# EAGLE schematic Arduino_S3v3_R2 (EAGLE 6.2)
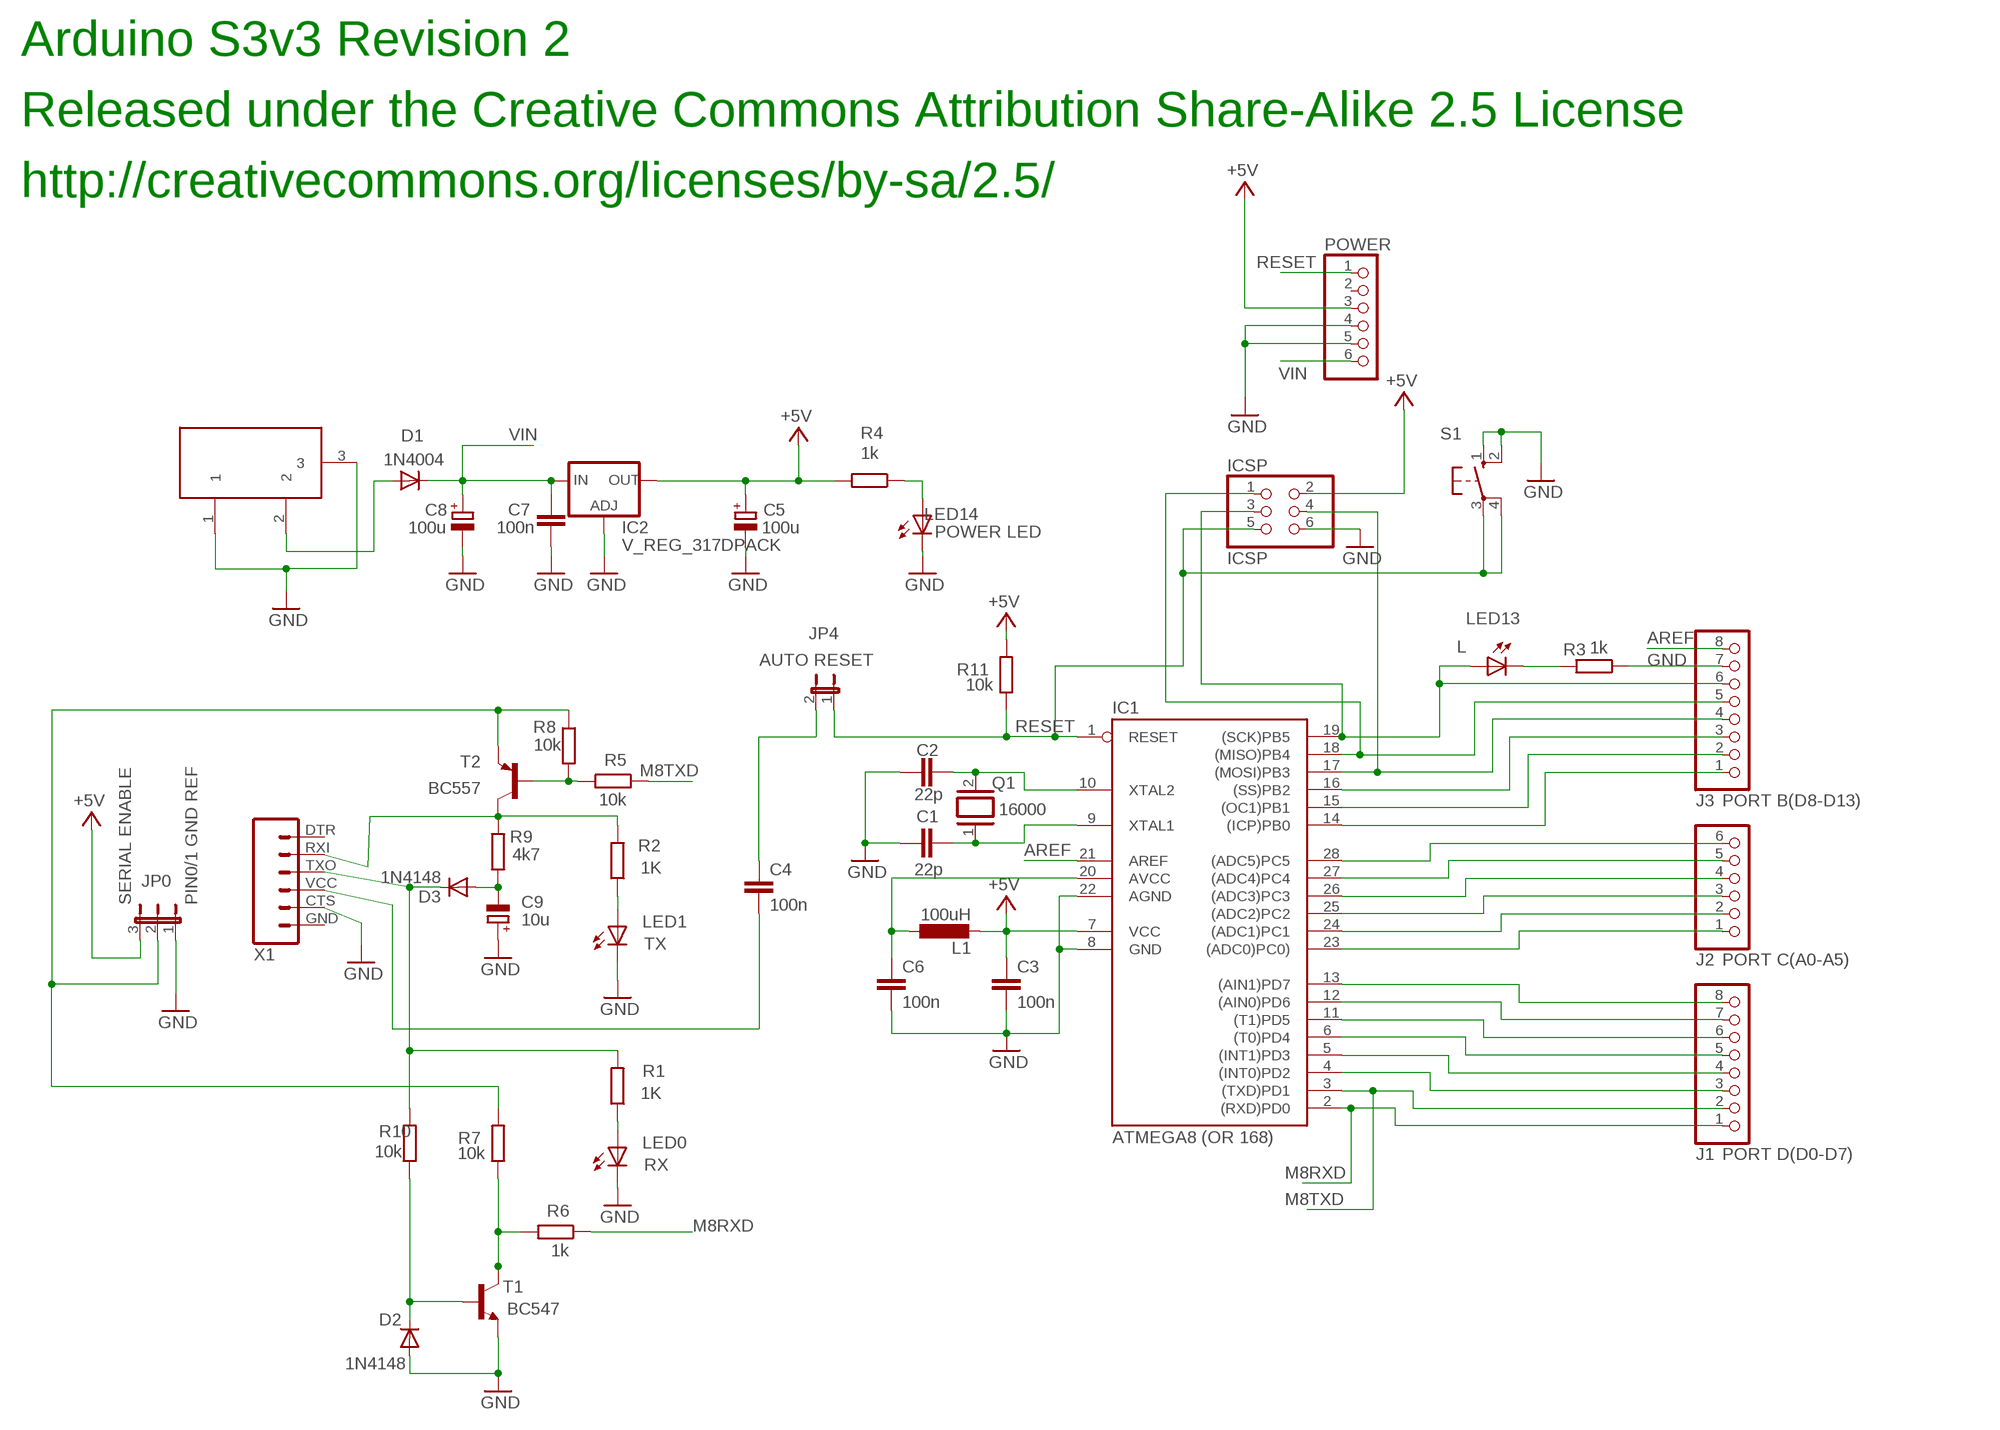
[diagram p0: schematic, sheet 1]

## Parts
C1  22p  C-EUC0805  [C0805]
C2  22p  C-EUC0805  [C0805]
C3  100n  C-EUC0805  [C0805]
C4  100n  C-EUC0805  [C0805]
C5  100u  CPOL-EUE3.5-8  [E3,5-8]
C6  100n  C-EUC0805  [C0805]
C7  100n  C-EUC0805  [C0805]
C8  100u  CPOL-EUE3.5-8  [E3,5-8]
C9  10u  CPOL-EUE5-6  [E5-6]
D1  1N4004  [DO41-10]
D2  1N4148  [DO35-10]
D3  1N4148  [DO35-10]
DC1  DC21MMX  [DC-21MM]
IC1  ATMEGA8 (OR 168)  AT90S4433P  [DIL28-3]
IC2  V_REG_317DPACK  [V-REG_DPACK]
ICSP  ICSP  PINHD-2X3  [2X03]
J1  PORT D(D0-D7)  PINHD-1X8  [1X08]
J2  PORT C(A0-A5)  PINHD-1X6  [1X06]
J3  PORT B(D8-D13)  PINHD-1X8  [1X08]
JP0  JP2W  [JP2W]
JP4  AUTO RESET  JP1W  [JP1W]
L1  100uH  L-EUL8530M  [L8530M]
LED0  RX  LEDCHIPLED_0603  [CHIPLED_0603]
LED1  TX  LEDCHIPLED_0603  [CHIPLED_0603]
LED13  L  LEDCHIPLED_0603  [CHIPLED_0603]
LED14  POWER LED  LEDCHIPLED_0603  [CHIPLED_0603]
POWER  PINHD-1X6  [1X06]
Q1  16000  XTAL  [Q]
R1  1K  R-EU_M0805  [M0805]
R2  1K  R-EU_M0805  [M0805]
R3  1k  R-EU_M0805  [M0805]
R4  1k  R-EU_M0805  [M0805]
R5  10k  R-EU_R0805  [R0805]
R6  1k  R-EU_R0805  [R0805]
R7  10k  R-EU_M0805  [M0805]
R8  10k  R-EU_M0805  [M0805]
R9  4k7  R-EU_M0805  [M0805]
R10  10k  R-EU_M0805  [M0805]
R11  10k  R-EU_M0805  [M0805]
S1  10-XX  [B3F-10XX]
T1  BC547  [TO92]
T2  BC557  BC557B-PNP-TO92-EBC  [TO92-EBC]
X1  FTDI_BASICPTH  [FTDI_BASIC]

## Nets
+5V [power]: C3.1 C5.+ IC1.7(VCC) IC2.4(OUT) ICSP.2 JP0.3 L1.2 POWER.3 R4.2 R11.2
AREF: IC1.21(AREF) J3.8
GND: C1.1 C2.1 C3.2 C5.- C6.2 C7.1 C8.- C9.+ D2.A DC1.1 DC1.3 IC1.8(GND) IC1.22(AGND) IC2.1(ADJ) ICSP.6 J3.7 JP0.1 LED0.C LED1.C LED14.C POWER.4 POWER.5 R3.1 S1.1(S) S1.2(S1) T1.1(E) X1.CTS
M8RXD: IC1.2((RXD)PD0) J1.1 R6.1
M8TXD: IC1.3((TXD)PD1) J1.2 R5.1
N$1: IC1.18((MISO)PB4) ICSP.1 J3.5
N$2: C9.- D3.A R9.1
N$3: LED14.A R4.1
N$4: IC1.17((MOSI)PB3) ICSP.4 J3.4
N$5: IC1.14((ICP)PB0) J3.1
N$6: C1.2 IC1.9(XTAL1) Q1.1
N$7: C2.2 IC1.10(XTAL2) Q1.2
N$8: D1.A DC1.2
N$10: IC1.4((INT0)PD2) J1.3
N$11: IC1.5((INT1)PD3) J1.4
N$12: IC1.6((T0)PD4) J1.5
N$13: IC1.11((T1)PD5) J1.6
N$14: IC1.12((AIN0)PD6) J1.7
N$15: IC1.13((AIN1)PD7) J1.8
N$16: IC1.23((ADC0)PC0)) J2.1
N$17: IC1.24((ADC1)PC1) J2.2
N$18: IC1.25((ADC2)PC2) J2.3
N$19: IC1.26((ADC3)PC3) J2.4
N$20: IC1.27((ADC4)PC4) J2.5
N$21: IC1.28((ADC5)PC5) J2.6
N$22: IC1.15((OC1)PB1) J3.2
N$23: IC1.16((SS)PB2) J3.3
N$25: D3.C R1.2 R10.2 X1.TXO
N$26: R6.2 R7.1 T1.3(C)
N$27: R5.2 R8.2 T2.B
N$29: D2.C R10.1 T1.2(B)
N$31: LED13.C R3.2
N$32: LED1.A R2.1
N$33: LED0.A R1.1
N$34: C4.1 JP4.2
N$38: C4.2 X1.VCC
N$39: R2.2 R9.2 T2.C X1.RXI
N$42 [power]: C6.1 IC1.20(AVCC) L1.1
RESET: IC1.1(RESET) ICSP.5 JP4.1 POWER.1 R11.1 S1.3(P) S1.4(P1)
SCK: IC1.19((SCK)PB5) ICSP.3 J3.6 LED13.A
SERIAL_VCC: JP0.2 R7.2 R8.1 T2.E
VIN [power]: C7.2 C8.+ D1.C IC2.3(IN) POWER.6
Unconnected: POWER.2 X1.DTR X1.GND

## Notes on the sheet
- Arduino S3v3 Revision 2
- Released under the Creative Commons Attribution Share-Alike 2.5 License
- http://creativecommons.org/licenses/by-sa/2.5/
- SERIAL ENABLE | PIN0/1 GND REF

## Library data of the parts
C1-C4 C6 C7 = rcl:C-EU: CAPACITOR, European symbol
C5 C8 C9 = rcl:CPOL-EU: POLARIZED CAPACITOR, European symbol
D1 = diode:1N4004: DIODE general purpose rectifier, 1 A
D2 D3 = diode:1N4148: DIODE high speed (Philips)
DC1 = powersupply:DC21MM
IC1 = atmel:AT90S4433: MICROCONTROLLER 4 Kbytes FLASH 128 bytes SRAM 256 bytes EEPROM UART 6-channel 10 bit ADC
IC2 = SparkFun:V_REG_317: Voltage Regulator Standard LM317 adjustable voltage regulator. AOI (Adjust Output Input). Google 'LM317 Calculator' for easy to use app to get the two resistor values needed. 240/720 for 5V output. 240/390 for 3.3V output. Spark Fun Electronics SKU : COM-00527
ICSP = pinhead:PINHD-2X3: PIN HEADER
J1 J3 = pinhead:PINHD-1X8: PIN HEADER
J2 POWER = pinhead:PINHD-1X6: PIN HEADER
JP0 = jumper:JP2W: JUMPER
JP4 = jumper:JP1W
L1 = rcl:L-EU: INDUCTOR, European symbol
LED0 LED1 LED13 LED14 = led:LED: LED OSRAM: - CHIPLED LG R971, LG N971, LY N971, LG Q971, LY Q971, LO R971, LY R971 LH N974, LH R974 LS Q976, LO Q976, LY Q976 LO Q996 - Hyper CHIPLED LW Q18S LB Q993, LB Q99A, LB R99A - SideLED LS A670, LO A670, LY A670, LG A670, LP A670 LB A673, LV A673, LT A673, LW A673 LH A674 LY A675 LS A676, LA A676, LO A676, LY A676, LW A676 LS A679, LY A679, LG A679 - Hyper Micro SIDELED® LS Y876, LA Y876, LO Y876, LY Y876 LT Y87S - SmartLED LW L88C, LW L88S LB L89C, LB L89S, LG L890 LS L89K, LO L89K, LY L89K LS L896, LA L896, LO L896, LY L896 - TOPLED LS T670, LO T670, LY T670, LG T670, LP T670 LSG T670, LSP T670, LSY T670, LOP T670, LYG T670 LG T671, LOG T671, LSG T671 LB T673, LV T673, LT T673, LW T673 LH T674 LS T676, LA T676, LO T676, LY T676, LB T676, LH T676, LSB T676, LW T676 LB T67C, LV T67C, LT T67C, LS T67K, LO T67K, LY T67K, LW E67C LS E67B, LA E67B, LO E67B, LY E67B, LB E67C, LV E67C, LT E67C LW T67C LS T679, LY T679, LG T679 LS T770, LO T770, LY T770, LG T770, LP T770 LB T773, LV T773, LT T773, LW T773 LH T774 LS E675, LA E675, LY E675, LS T675 LS T776, LA T776, LO T776, LY T776, LB T776 LHGB T686 LT T68C, LB T68C - Hyper Mini TOPLED® LB M676 - Mini TOPLED Santana® LG M470 LS M47K, LO M47K, LY M47K Source: http://www.osram.convergy.de/
Q1 = special:XTAL: CRYSTAL
R1-R11 = rcl:R-EU_: RESISTOR, European symbol
S1 = switch-omron:10-XX: OMRON SWITCH
T1 = transistor:BC547: NPN TRANSISTOR
T2 = transistor:*-PNP-: PNP Transistror
X1 = SparkFun:FTDI_BASIC: FTDI Basic: 3.3V and 5V

## Net classes
1 power: width 0.61 mm